# Altium schematic sheet Boost Converter XL6009.SchDoc
size A4
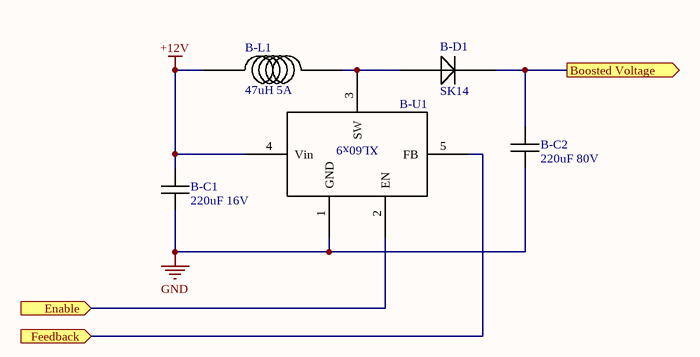
[diagram p0: Boost Converter XL6009.SchDoc]

## Parts
B-C1  220uF 16V  [C 0805 / 2012]
B-C2  220uF 80V  [C 0805 / 2012]
B-D1  SK14
B-L1  47uH 5A
B-U1  XL6009  (value not drawn)

## Ports
Boosted Voltage (out), Enable (in), Feedback (in)

## Nets
+12V: B-C1.1 B-L1.1 B-U1.4(Vin)
GND: B-C1.2 B-C2.2 B-U1.1(GND)
Boosted Voltage: B-C2.1 B-D1.1 ; port Boosted Voltage
Enable: B-U1.2(EN) ; port Enable
Feedback: B-U1.5(FB) ; port Feedback
NetB-D1_2: B-D1.2 B-L1.2 B-U1.3(SW)

## Library data of the parts
B-C1 B-C2 = Capacitor
B-D1 = Diode
B-L1 = Coil
B-U1 = XL60x9: Buck-/Boost-Converter